# EasyEDA Pro project ProProject_TC264裸片板_2024-07-09.epro, schematic Schematic1
Create Date: 2024-06-23; Page Name: P1; Project Name: TC264裸片板; Schematic Name: Schematic1; Update Date: 2024-06-26; Company: 嘉立创EDA; Page Size: A4; Version: V1.0
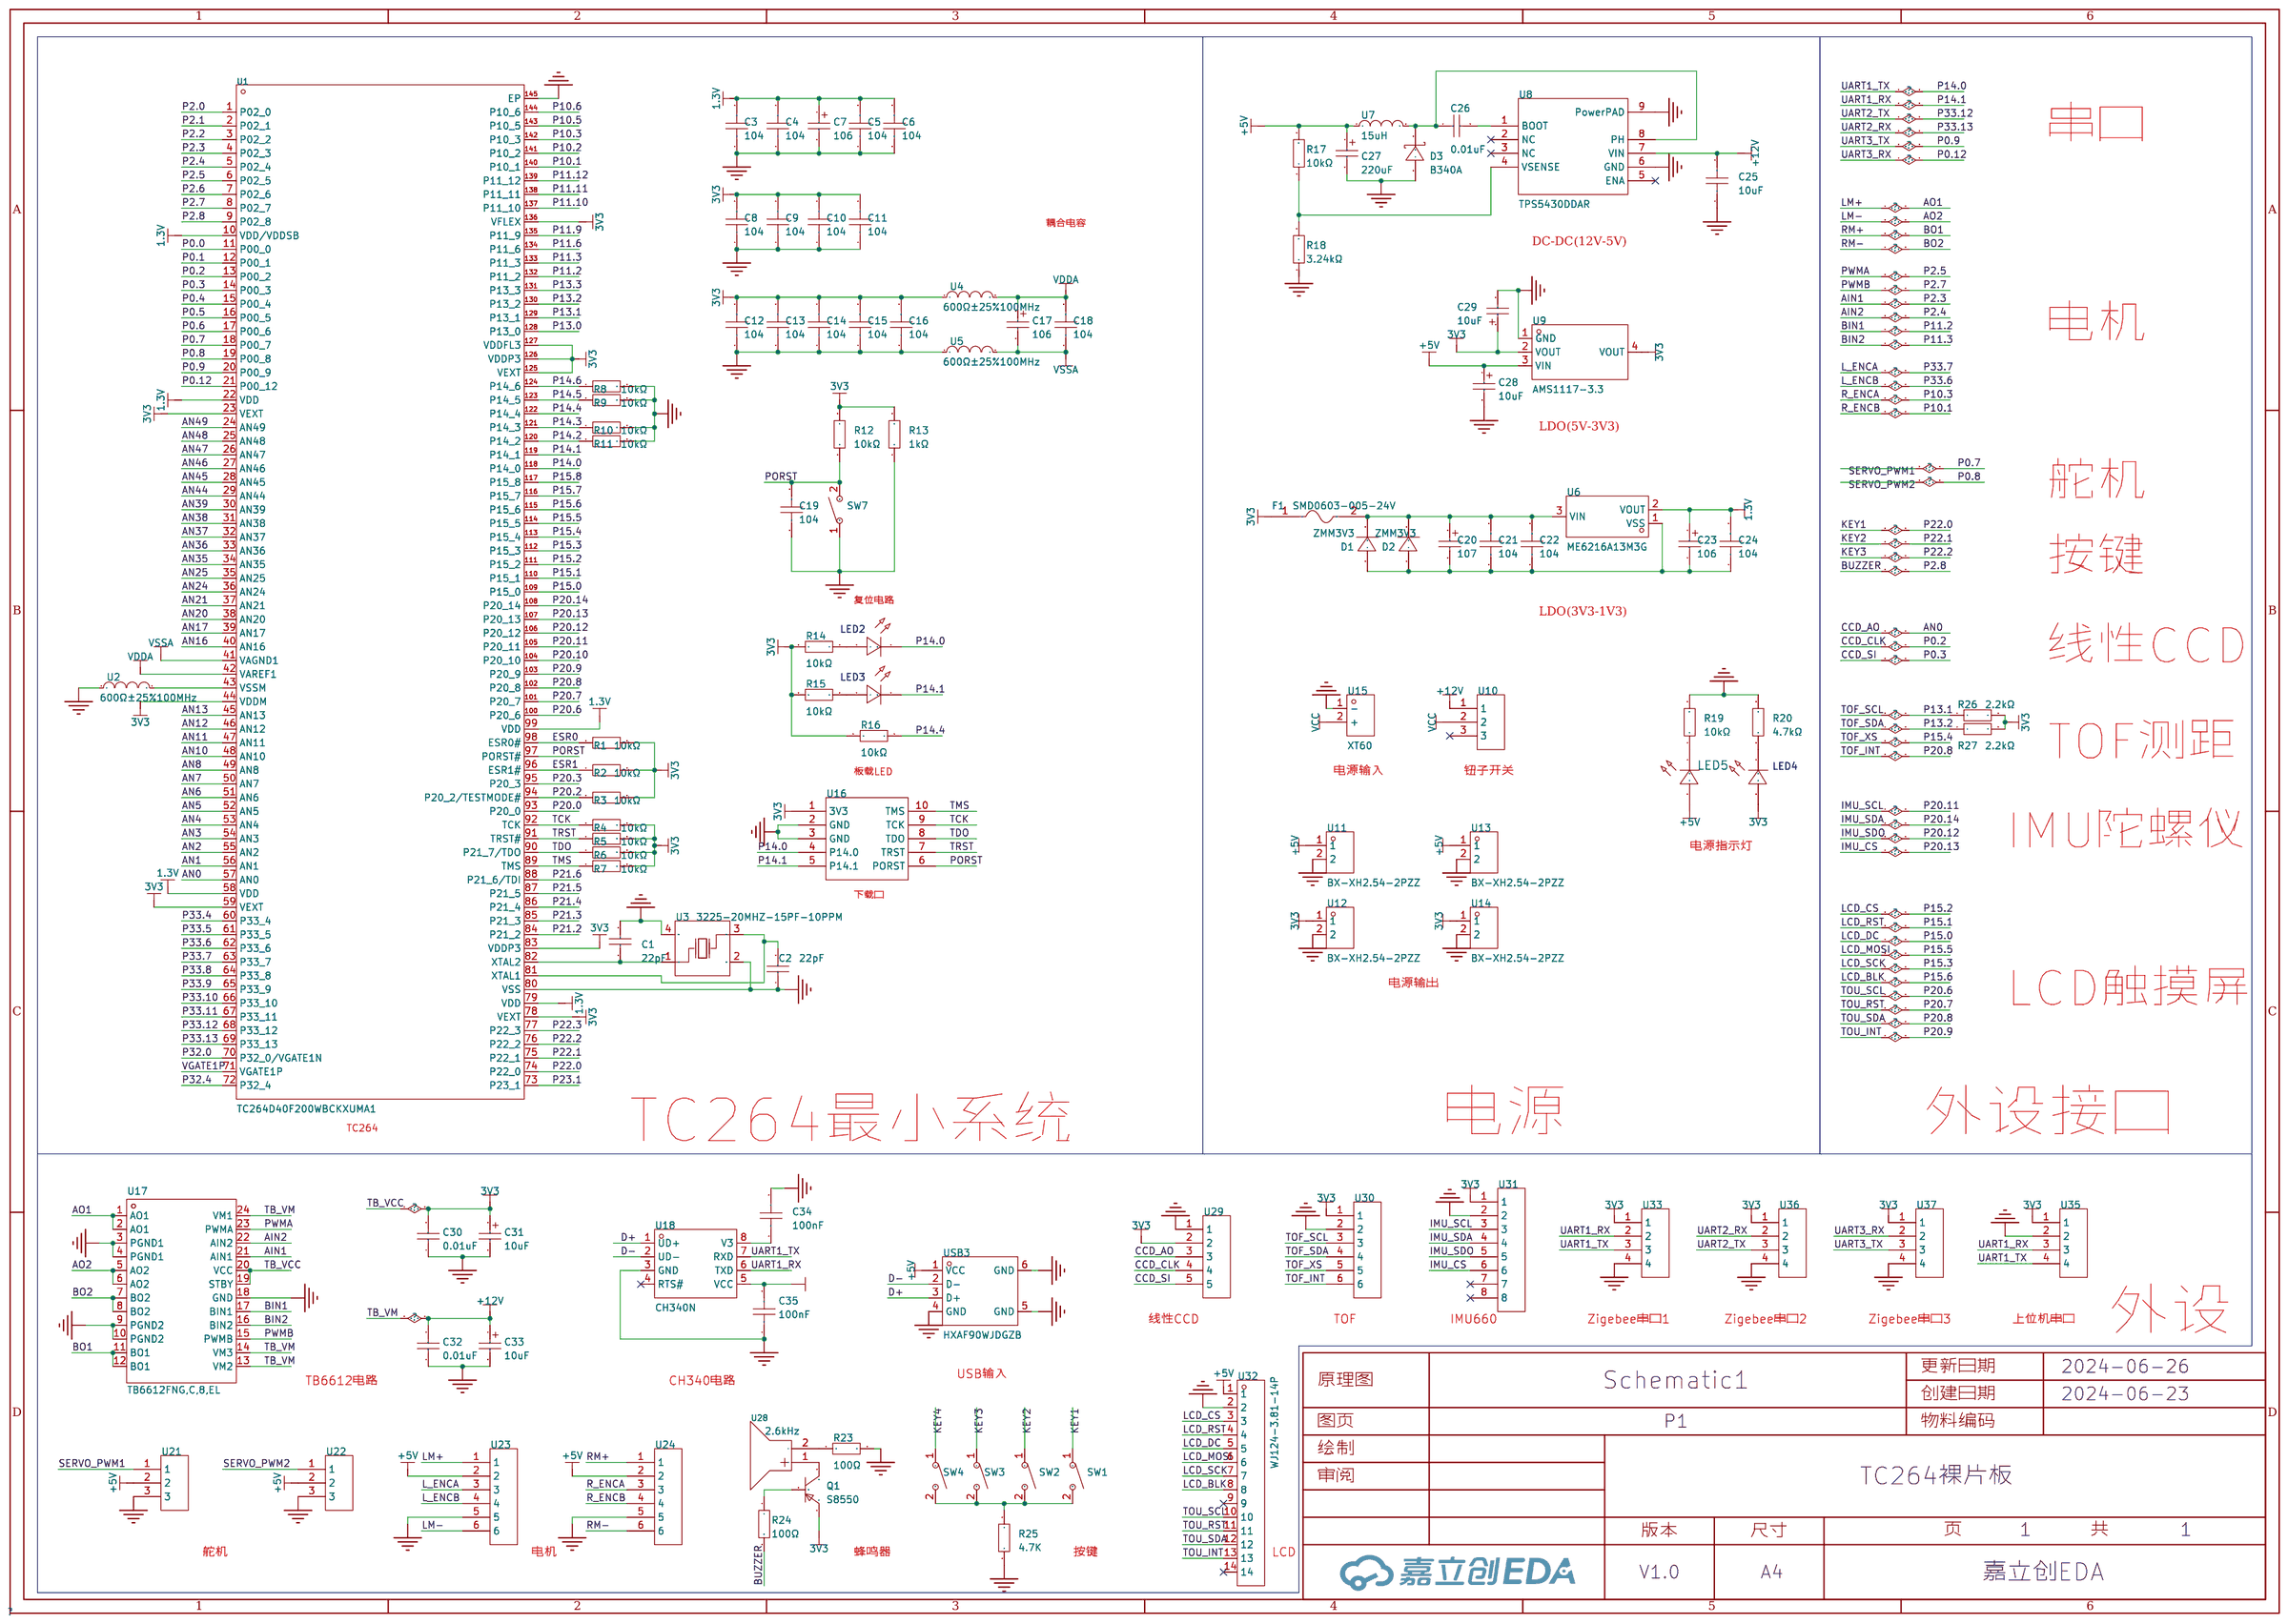
[diagram p0: schematic sheet]

## Parts
C1  22pF  [C0603]
C2  22pF  [C0603]
C3  104  [C0603]
C4  104  [C0603]
C5  104  [C0603]
C6  104  [C0603]
C7  106  [CAP-SMD_L3.2-W1.6-FD]
C8  104  [C0603]
C9  104  [C0603]
C10  104  [C0603]
C11  104  [C0603]
C12  104  [C0603]
C13  104  [C0603]
C14  104  [C0603]
C15  104  [C0603]
C16  104  [C0603]
C17  106  [CAP-SMD_L3.2-W1.6-FD]
C18  104  [C0603]
C19  104  [C0603]
C20  107  [CAP-SMD_L3.2-W1.6-FD]
C21  104  [C0603]
C22  104  [C0603]
C23  106  [CAP-SMD_L3.2-W1.6-FD]
C24  104  [C0603]
C25  10uF  [C0603]
C26  0.01uF  [C0603]
C27  220uF  [CAP-SMD_L6.0-W3.2-R-RD]
C28  10uF  [CAP-SMD_L6.0-W3.2-R-RD]
C29  10uF  [CAP-SMD_L6.0-W3.2-R-RD]
C30  0.01uF  [C0603]
C31  10uF  [CAP-SMD_L6.0-W3.2-R-RD]
C32  0.01uF  [C0603]
C33  10uF  [CAP-SMD_L6.0-W3.2-R-RD]
C34  100nF  [C0603]
C35  100nF  [C0603]
D1  ZMM3V3  [LL-34_L3.5-W1.5-LS3.5-FD]
D2  ZMM3V3  [LL-34_L3.5-W1.5-LS3.5-FD]
D3  B340A  [SMA_L4.3-W2.6-LS5.1-RD]
F1  SMD0603-005-24V  [F0603]
LED2  -  [LED_0603]
LED3  -  [LED_0603]
LED4  -  [LED_0402]
LED5  -  [LED_0402]
Q1  S8550  [SOT-23-3_L2.9-W1.6-P1.90-LS2.8-BR]
R1  10kΩ  [R0603]
R2  10kΩ  [R0603]
R3  10kΩ  [R0603]
R4  10kΩ  [R0603]
R5  10kΩ  [R0603]
R6  10kΩ  [R0603]
R7  10kΩ  [R0603]
R8  10kΩ  [R0603]
R9  10kΩ  [R0603]
R10  10kΩ  [R0603]
R11  10kΩ  [R0603]
R12  10kΩ  [R0603]
R13  1kΩ  [R0603]
R14  10kΩ  [R0603]
R15  10kΩ  [R0603]
R16  10kΩ  [R0603]
R17  10kΩ  [R0603]
R18  3.24kΩ  [R0603]
R19  10kΩ  [R0603]
R20  4.7kΩ  [R0603]
R23  100Ω  [R0603]
R24  100Ω  [R0603]
R25  4.7K  [R0603]
R26  2.2kΩ  [R0603]
R27  2.2kΩ  [R0603]
SW1  轻触按键3*6*2.5  [SW-SMD_L6.0-W3.6-LS8.0]
SW2  轻触按键3*6*2.5  [SW-SMD_L6.0-W3.6-LS8.0]
SW3  轻触按键3*6*2.5  [SW-SMD_L6.0-W3.6-LS8.0]
SW4  轻触按键3*6*2.5  [SW-SMD_L6.0-W3.6-LS8.0]
SW7  轻触按键3*6*2.5  [SW-SMD_L6.0-W3.6-LS8.0]
U1  TC264D40F200WBCKXUMA1  [LQFP-144_L20.0-W20.0-P0.50-LS22.0-BL-EP]
U2  600Ω±25%100MHz  [L0603]
U3  3225-20MHZ-15PF-10PPM  [CRYSTAL-SMD_4P-L3.2-W2.5-BL]
U4  600Ω±25%100MHz  [L0603]
U5  600Ω±25%100MHz  [L0603]
U6  ME6216A13M3G  [SOT-23-3_L3.0-W1.7-P0.95-LS2.9-BR]
U7  15uH  [IND-SMD_L6.6-W6.6]
U8  TPS5430DDAR  [ESOP-8_L4.9-W3.9-P1.27-LS6.0-TL-EP]
U9  AMS1117-3.3  [SOT-223-3_L6.5-W3.4-P2.30-LS7.0-BR]
U10  -  [钮子开关]
U11  BX-XH2.54-2PZZ  [CONN-TH_2P-P2.50_BX-XH2.54-2PZZ]
U12  BX-XH2.54-2PZZ  [CONN-TH_2P-P2.50_BX-XH2.54-2PZZ]
U13  BX-XH2.54-2PZZ  [CONN-TH_2P-P2.50_BX-XH2.54-2PZZ]
U14  BX-XH2.54-2PZZ  [CONN-TH_2P-P2.50_BX-XH2.54-2PZZ]
U15  XT60  [CONN-TH_XT60]
U16  -  [TC264]
U17  TB6612FNG,C,8,EL  [SSOP-24_L8.3-W5.6-P0.65-LS7.6-BL]
U18  CH340N  [SOP-8_L4.9-W3.9-P1.27-LS6.0-BL]
U21  -  [X2.54_3p]
U22  -  [X2.54_3p]
U23  -  [XH2.54_6p]
U24  -  [XH2.54_6p]
U28  2.6kHz  [BUZ-TH_BD12.0-P7.60-D0.6-FD]
U29  -  [X2.54_5p]
U30  -  [XH2.54_6p]
U31  -  [MPU6050-8p]
U32  WJ124-3.81-14P  [电容触摸]
U33  -  [XH2.54-4p]
U35  -  [XH2.54-4p]
U36  -  [XH2.54-4p]
U37  -  [XH2.54-4p]
USB3  HXAF90WJDGZB  [USB-A-TH_HXAF90WJDGZB]

## Library data of the parts
C1 C2 = CC0603JRNPO9BN220: 容值:22pF;精度:±5%;额定电压:50V;材质(温度系数):NP0;; LCSC Part Name: 22pF ±5% 50V; Supplier Part: C105620; Manufacturer: YAGEO(国巨); Supplier Footprint: 0603; JLCPCB Part Class: 扩展库; Datasheet: https://atta.szlcsc.com/upload/public/pdf/source/20170505/1493957838062.pdf; Supplier: LCSC; Tolerance: ±5%; Voltage Rated: 50V; Temperature Coefficient: NP0
C3-C6 C8-C16 C18 C19 C21 C22 C24 C34 = CAP_0603: Supplier Footprint: 0603
C7 C17 C20 C23 = C_Ele_SMD_3x5.4mm: Supplier Footprint: SMD,3x5.4mm
C25 = CL10A106KP8NNNC: 容值:10uF;精度:±10%;额定电压:10V;材质(温度系数):X5R;; LCSC Part Name: 10uF ±10% 10V; Supplier Part: C19702; Manufacturer: SAMSUNG(三星); Supplier Footprint: 0603; JLCPCB Part Class: 基础库; Datasheet: https://atta.szlcsc.com/upload/public/pdf/source/20160218/1457707763339.pdf; Supplier: LCSC; Tolerance: ±10%; Voltage Rated: 10V; Temperature Coefficient: X5R
C26 C30 C32 = CL10C100JB8NNNC: 容值:10pF;精度:±5%;额定电压:50V;材质(温度系数):C0G;; LCSC Part Name: 10pF ±5% 50V; Supplier Part: C1634; Manufacturer: SAMSUNG(三星); Supplier Footprint: 0603; JLCPCB Part Class: 基础库; Datasheet: https://atta.szlcsc.com/upload/public/pdf/source/20160218/1457707763339.pdf; Supplier: LCSC; Tolerance: ±5%; Voltage Rated: 50V; Temperature Coefficient: C0G
C27-C29 C31 C33 = TAJC227K010RNJ: 容值:220uF;精度:±10%;额定电压:10V;等效串联电阻:500mΩ@100kHz;; LCSC Part Name: 220uF ±10% 10V; Supplier Part: C8023; Manufacturer: Kyocera AVX; Supplier Footprint: CASE-C-6032; JLCPCB Part Class: 扩展库; Datasheet: https://atta.szlcsc.com/upload/public/pdf/source/20160107/1457707750344.pdf; Supplier: LCSC; Tolerance: ±10%; Rated Voltage: 10V; Equivalent Series Resistance(ESR): 500mΩ@100kHz; Operating Temperature: -55℃~+125℃
C35 = CAP_0805: Supplier Footprint: 0805; Origin Footprint 2: C0805
D1 D2 = ZMM3V3: 二极管配置:-;稳压值(标称值):3.3V;稳压值(范围):3.1V~3.5V;功率:500mW;精度:-;; Supplier Part: C2857242; Manufacturer: JSMSEMI(杰盛微); Supplier Footprint: LL-34; JLCPCB Part Class: 扩展库; Datasheet: https://atta.szlcsc.com/upload/public/pdf/source/20240105/AB2CCC1AF8AC07DFF2A37C65A0EBD01D.pdf; Supplier: LCSC; Zener Voltage (Nom): 3.3V; Reverse Leakage Current (Ir): 2uA@1V; Zener Voltage (Range): 3.1V~3.5V; Power Dissipation: 500mW; Zener Impedance (Zzt): 90Ω
D3 = B340A: 正向压降(Vf):550mV@3A;直流反向耐压(Vr):40V;平均整流电流(Io):3A;; LCSC Part Name: 电压:40V 电流:3A; Supplier Part: C64982; Manufacturer: MDD; Supplier Footprint: SMA(DO-214AC); JLCPCB Part Class: 扩展库; Datasheet: https://atta.szlcsc.com/upload/public/pdf/source/20230710/CC7CF81239BC87A7012E02A96905E83C.pdf; Supplier: LCSC; Forward Voltage (Vf@If): 550mV@3A; Reverse Voltage (Vr): 40V; Average Rectified Current (Io): 3A
F1 = SMD0603-005-24V: 最大电压:24V;最大电流:40A;保持电流:50mA;跳闸电流:200mA;; LCSC Part Name: 0.05A  24V 自恢复保险丝; Supplier Part: C70046; Manufacturer: 台湾陆海; Supplier Footprint: 0603; JLCPCB Part Class: 扩展库; Datasheet: https://atta.szlcsc.com/upload/public/pdf/source/20230404/2712EB29DF44AB86EE68CBFAEF7847D1.pdf; Supplier: LCSC; Operating Voltage (Max): 24V; Current Rating (Max): 40A; Hold Current: 50mA; Trip Current: 200mA
LED2 LED3 = LED_0603-G: Supplier Footprint: 0603
LED4 = LED_0402-G: Supplier Footprint: 0402
LED5 = LED_0402-R: Supplier Footprint: 0402
Q1 = S8550_C105432: 晶体管类型:PNP;集电极电流(Ic):500mA;集射极击穿电压(Vceo):25V;功率(Pd):300mW;直流电流增益(hFE@Ic,Vce):120@50mA,1V;; LCSC Part Name: S8550(RANGE:120-200) L档120-200; Supplier Part: C105432; Manufacturer: CJ(江苏长电/长晶); Supplier Footprint: SOT-23; JLCPCB Part Class: 基础库; Datasheet: https://atta.szlcsc.com/upload/public/pdf/source/20171228/C164891_15144412930301213894.pdf; Supplier: LCSC; Transistor Type: PNP; Collector Current (Ic): 500mA; Collector-Emitter Breakdown Voltage (Vceo): 25V; Power Dissipation (Pd): 300mW; DC Current Gain (hFE@Ic,Vce): 120@50mA,1V; Transition Frequency (fT): 150MHz; Collector Cut-Off Current (Icbo): 100nA; Collector-Emitter Saturation Voltage (VCE(sat)@Ic,Ib): 600mV@500mA,50mA
R1-R18 = 0603WAF1002T5E: 电阻类型:厚膜电阻;阻值:10kΩ;精度:±1%;功率:100mW;最大工作电压:75V;温度系数:±100ppm/℃;; LCSC Part Name: 厚膜电阻 10kΩ ±1% 100mW; Supplier Part: C25804; Manufacturer: UNI-ROYAL(厚声); Supplier Footprint: 0603; JLCPCB Part Class: 基础库; Datasheet: https://atta.szlcsc.com/upload/public/pdf/source/20200306/C422600_1E6D84923E4A46A82E41ADD87F860B5C.pdf; Supplier: LCSC; Type: 厚膜电阻; Tolerance: ±1%; Power(Watts): 100mW; Overload Voltage (Max): 75V; Temperature Coefficient: ±100ppm/℃; Operating Temperature Range: -55℃~+155℃
R19 R20 R26 R27 = 0603WAF4701T5E: 电阻类型:厚膜电阻;阻值:4.7kΩ;精度:±1%;功率:100mW;最大工作电压:75V;温度系数:±100ppm/℃;; LCSC Part Name: 4.7kΩ ±1% 100mW 厚膜电阻; Supplier Part: C23162; Manufacturer: UNI-ROYAL(厚声); Supplier Footprint: 0603; JLCPCB Part Class: 基础库; Datasheet: https://atta.szlcsc.com/upload/public/pdf/source/20200306/C422600_1E6D84923E4A46A82E41ADD87F860B5C.pdf; Supplier: LCSC; Type: 厚膜电阻; Tolerance: ±1%; Power(Watts): 100mW; Overload Voltage (Max): 75V; Temperature Coefficient: ±100ppm/℃; Operating Temperature Range: -55℃~+155℃
R23-R25 = Res_0603: Supplier Footprint: 0603
SW1-SW4 SW7 = 轻触按键3*6*2.5: Supplier Part: C9900013040; Supplier Footprint: KEY; JLCPCB Part Class: 扩展库; Supplier: LCSC
U1 = TC264D40F200WBCKXUMA1: CPU内核:其他系列;程序存储容量:2.5MB;RAM总容量:240KB;GPIO端口数量:88;工作电压范围:-;CPU最大主频:200MHz;程序存储器类型:FLASH;; Supplier Part: C1848806; Manufacturer: Infineon(英飞凌); Supplier Footprint: LQFP-144(20x20); JLCPCB Part Class: 扩展库; Datasheet: https://atta.szlcsc.com/upload/public/pdf/source/20211207/2726C98290045E30600065CD02247ED6.pdf; Supplier: LCSC; CPU Core: 其他系列; Program Storage Size: 2.5MB; RAM Size: 240KB; GPIO Ports Number: 88; CPU Maximum Speed: 200MHz; Program Memory Type: FLASH; Operating Temperature Range: -40℃~+125℃; ADC (Bit): 12bit; Peripheral/Function: DMA；看门狗；LIN总线协议；以太网协议栈; communication protocol: 以太网协议; Watchdog: 有; Direct Memory Access: 有; Internal Oscillator: 有
U2 U4 U5 = 600Ω±25%100MHz: Supplier Part: C9900021526; Supplier Footprint: L0805; JLCPCB Part Class: 扩展库; Supplier: LCSC
U3 = 3225-20MHZ-15PF-10PPM_C712026: Supplier Part: C712026; Supplier Footprint: SMD3225; JLCPCB Part Class: 扩展库; Supplier: LCSC
U6 = ME6216A13M3G: 输出类型:固定;最大输入电压:6V;输出电压:1.3V;最大输出电流:250mA;电源纹波抑制比(PSRR):65dB@(1kHz);输出极性:正极;; LCSC Part Name: 输入6V 输出1.3V 250mA; Supplier Part: C236662; Manufacturer: MICRONE(南京微盟); Supplier Footprint: SOT-23; JLCPCB Part Class: 扩展库; Datasheet: https://atta.szlcsc.com/upload/public/pdf/source/20180830/C126464_0BBD9EEE19BBEC9552A447E8A4FCE12E.pdf; Supplier: LCSC; Output Type: 固定; Maximum Input Voltage: 6V; Output Voltage: 1.3V; MAX Output Current: 250mA; Power Supply Rejection Ratio (PSRR): 65dB@(1kHz); Output Polarity: 正极; Number of Outputs: 1
U7 = 15uH: Supplier Part: C9900014578; Supplier Footprint: L_电感_7*7; JLCPCB Part Class: 扩展库; Supplier: LCSC
U8 = TPS5430DDAR: 功能类型:降压型;输出类型:可调;输入电压:5.5V~36V;输出电压:1.221V~32.04V;输出电流(最大值):3A;; LCSC Part Name: 降压 3A 36V; Supplier Part: C9864; Manufacturer: TI(德州仪器); Supplier Footprint: SOIC-8-EP; JLCPCB Part Class: 基础库; Datasheet: https://www.ti.com/cn/lit/gpn/tps5430; Supplier: LCSC; Function: 降压型; Output Type: 可调; Input Voltage: 5.5V~36V; Output Voltage: 1.221V~32.04V; Output Current (Max): 3A; Switching Frequency: 500kHz; Operating Temperature: -40℃~+125℃@(TJ); Synchronous Rectification: 否; Number of Outputs: 1; Topology: 降压式; Switch tube (built-in/external): 内置
U9 = AMS1117-3.3_C6186: 输出类型:固定;最大输入电压:-;输出电压:3.3V;最大输出电流:1A;电源纹波抑制比(PSRR):72dB@(120Hz);输出极性:正极;; LCSC Part Name: 输出3.3V 1A; Supplier Part: C6186; Manufacturer: AMS; Supplier Footprint: SOT-223; JLCPCB Part Class: 基础库; Datasheet: https://atta.szlcsc.com/upload/public/pdf/source/20180727/C6186_7A095716F0823C02F1997A905E26C086.pdf; Supplier: LCSC; Output Type: 固定; Output Voltage: 3.3V; MAX Output Current: 1A; Power Supply Rejection Ratio (PSRR): 72dB@(120Hz); Dropout Voltage: 1.3V@(800mA); Output Polarity: 正极; Number of Outputs: 1
U10 = 钮子开关
U11-U14 = BX-XH2.54-2PZZ: 插针结构:1x2P;间距:2.54mm;安装方式:直插;参考系列:XH;总PIN数:2P;排数:1;每排PIN数:2;行距:-;额定电流:3A;触头材质:黄铜;触头镀层:锡;工作温度范围:-25℃~+85℃;; Supplier Part: C18077833; Manufacturer: Bossie(博锡); Supplier Footprint: 插件,P=2.54mm; Datasheet: https://atta.szlcsc.com/upload/public/pdf/source/20231017/CB25E46A13930659CD6CDE2F2553A508.pdf; Supplier: LCSC; Pins Structure: 1x2P; Pitch: 2.54mm; Mounting Style: 直插; Reference Series: XH; Number of Pins: 2P; Number of Rows: 1; Number of PINs Per Row: 2; Current Rating (Max): 3A; Contact Material: 黄铜; Contact Plating: 锡; Operating Temperature Range: -25℃~+85℃
U15 = XT60: 类别:-;类型1:-;; LCSC Part Name: AMASS(艾迈斯) XT60模型插头 3.5mm镀金香蕉头公头（电调端）XT60-M; Supplier Part: C98733; Manufacturer: AMASS(艾迈斯); JLCPCB Part Class: 扩展库; Datasheet: https://atta.szlcsc.com/upload/public/pdf/source/20170606/1496716524919.pdf; Supplier: LCSC; Brand: 艾迈斯; Type: 香蕉头; Colour: 黄色; InterfaceType: 公头; specifications: 3.5mm
U16 = TC264下载口
U17 = TB6612FNG,C,8,EL: 驱动电机类型:有刷直流电机;电源电压:2.7V~5.5V;输出电流:1A;接口:并行;; LCSC Part Name: 1A 有刷直流电机驱动芯片 5.5V; Supplier Part: C141517; Manufacturer: TOSHIBA(东芝); Supplier Footprint: SSOP-24; JLCPCB Part Class: 扩展库; Datasheet: https://atta.szlcsc.com/upload/public/pdf/source/20171128/C141517_15118625624231147036.pdf; Supplier: LCSC; Drive motor type: 有刷直流电机; Supply Voltage: 2.7V~5.5V; Output Current: 1A; Interface: 并行; Operating Temperature: -20℃~+85℃@(Ta)
U18 = CH340N: LCSC Part Name: USB转串口芯片 CH340; Supplier Part: C2977777; Manufacturer: WCH(南京沁恒); Supplier Footprint: SOP-8; JLCPCB Part Class: 扩展库; Datasheet: https://atta.szlcsc.com/upload/public/pdf/source/20230530/6E401E9554E9F5311886CC8B3F89B62E.pdf; Supplier: LCSC
U21 U22 = X2.54 _3p
U23 U24 U30 = XH2.54_6p
U28 = HYE1206-05ST: 频率:2.6kHz;声压(SPL):80dB@5V,10cm;; LCSC Part Name: 有源蜂鸣器HYE1206-05ST; Supplier Part: C17701079; Manufacturer: HYDZ(华宇); Supplier Footprint: 插件,D=7.6mm; Datasheet: https://atta.szlcsc.com/upload/public/pdf/source/20230912/EF3443D3A1B92F495A3EE65EE7F2091F.pdf; Supplier: LCSC; Sound Pressure Level (SPL): 80dB@5V,10cm
U29 = X2.54_5p
U31 = MPU6050_8p
U32 = WJ124-3.81-14P: Supplier Part: C9900012814; Supplier Footprint: 3.81-14P; JLCPCB Part Class: 扩展库; Supplier: LCSC
U33 U35-U37 = XH2.54_4P
USB3 = HXAF90WJDGZB: Supplier Part: C9900088453; Supplier Footprint: USB母座; JLCPCB Part Class: 扩展库; Supplier: LCSC

## Nets
1.3V: C3.2 C4.2 C5.2 C6.2 C7.1 C23.1 C24.2 U1.10(VDD/VDDSB) U1.22(VDD) U1.58(VDD) U1.79(VDD) U1.99(VDD) U6.2(VOUT)
3V3: C8.2 C9.2 C10.2 C11.2 C12.2 C13.2 C14.2 C15.2 C16.2 C29.1 C30.2 C31.1 C35.2 F1.1 LED4.2(A) Q1.2 R1.2 R2.2 R3.2 R4.2 R5.2 R6.2 R7.2 R12.2 R13.2 R14.2 R15.2 R16.2 R26.2 R27.2 U1.23(VEXT) U1.44(VDDM) U1.59(VEXT) U1.78(VEXT) U1.83(VDDP3) U1.125(VEXT) U1.126(VDDP3) U1.127(VDDFL3) U1.136(VFLEX) U4.1 U9.2(VOUT) U9.4(VOUT) U12.1 U14.1 U16.1(3V3) U17.19(STBY) U17.20(VCC) U18.5(VCC) U29.2 U30.1 U31.1 U33.1 U35.1 U36.1 U37.1
+5V: C27.1 C28.1 LED5.2(A) R17.2 U7.1 U9.3(VIN) U11.1 U13.1 U21.2 U22.2 U23.2 U24.2 U32.1 USB3.1(VCC)
+12V: C25.2 C32.2 C33.1 U8.7(VIN) U10.1 U17.13(VM2) U17.14(VM3) U17.24(VM1)
GND: C1.2 C2.1 C3.1 C4.1 C5.1 C6.1 C7.2 C8.1 C9.1 C10.1 C11.1 C12.1 C13.1 C14.1 C15.1 C16.1 C19.1 C25.1 C27.2 C28.2 C29.2 C30.1 C31.2 C32.1 C33.2 C34.2 C35.1 D3.2(A) R8.2 R9.2 R10.2 R11.2 R13.1 R18.1 R19.2 R20.2 R23.2 R25.2 SW7.1 U1.80(VSS) U1.145(EP) U2.1 U3.2(GND) U3.4(GND) U5.1 U8.6(GND) U8.9(PowerPAD) U9.1(GND) U11.2 U12.2 U13.2 U14.2 U15.1(-) U16.2(GND) U16.3(GND) U17.3(PGND1) U17.4(PGND1) U17.9(PGND2) U17.10(PGND2) U17.18(GND) U18.3(GND) U21.3 U22.3 U23.5 U24.5 U29.1 U30.2 U31.2 U32.2 U33.4 U35.2 U36.4 U37.4 USB3.4(GND) USB3.5(GND) USB3.6(GND)
VCC: U10.2 U15.2(+)
VDDA: C17.1 C18.2 U1.42(VAREF1) U4.2
VSSA: C17.2 C18.1 U1.41(VAGND1) U5.2
AIN1: U1.4(P02_3) U17.21(AIN1)
AIN2: U1.5(P02_4) U17.22(AIN2)
AN0: U1.57(AN0) U29.3
AN1: U1.56(AN1)
AN2: U1.55(AN2)
AN3: U1.54(AN3)
AN4: U1.53(AN4)
AN5: U1.52(AN5)
AN6: U1.51(AN6)
AN7: U1.50(AN7)
AN8: U1.49(AN8)
AN10: U1.48(AN10)
AN11: U1.47(AN11)
AN12: U1.46(AN12)
AN13: U1.45(AN13)
AN16: U1.40(AN16)
AN17: U1.39(AN17)
AN20: U1.38(AN20)
AN21: U1.37(AN21)
AN24: U1.36(AN24)
AN25: U1.35(AN25)
AN35: U1.34(AN35)
AN36: U1.33(AN36)
AN37: U1.32(AN37)
AN38: U1.31(AN38)
AN39: U1.30(AN39)
AN44: U1.29(AN44)
AN45: U1.28(AN45)
AN46: U1.27(AN46)
AN47: U1.26(AN47)
AN48: U1.25(AN48)
AN49: U1.24(AN49)
AO1: U17.1(AO1) U17.2(AO1) U23.1
AO2: U17.5(AO2) U17.6(AO2) U23.6
BIN1: U1.132(P11_2) U17.17(BIN1)
BIN2: U1.133(P11_3) U17.16(BIN2)
BO1: U17.11(BO1) U17.12(BO1) U24.1
BO2: U17.7(BO2) U17.8(BO2) U24.6
BUZZER: R24.2 U1.9(P02_8)
CCD_CLK: U1.13(P00_2) U29.4
CCD_SI: U1.14(P00_3) U29.5
D+: U18.1(UD+) USB3.3(D+)
D-: U18.2(UD-) USB3.2(D-)
ESR0: R1.1 U1.98(ESR0#)
ESR1: R2.1 U1.96(ESR1#)
IMU_CS: U1.107(P20_13) U31.6
IMU_SCL: U1.105(P20_11) U31.3
IMU_SDA: U1.108(P20_14) U31.4
IMU_SDO: U1.106(P20_12) U31.5
KEY1: SW1.1 U1.74(P22_0)
KEY2: SW2.1 U1.75(P22_1)
KEY3: SW3.1 U1.76(P22_2)
KEY4: SW4.1
L_ENCA: U1.63(P33_7) U23.3
L_ENCB: U1.62(P33_6) U23.4
LCD_BLK: U1.115(P15_6) U32.8
LCD_CS: U1.111(P15_2) U32.3
LCD_DC: U1.109(P15_0) U32.5
LCD_MOSI: U1.114(P15_5) U32.6
LCD_RST: U1.110(P15_1) U32.4
LCD_SCK: U1.112(P15_3) U32.7
P0.0: U1.11(P00_0)
P0.1: U1.12(P00_1)
P0.4: U1.15(P00_4)
P0.5: U1.16(P00_5)
P0.6: U1.17(P00_6)
P0.7: U1.18(P00_7) U21.1
P0.8: U1.19(P00_8) U22.1
P0.9: U1.20(P00_9) U37.3
P0.12: U1.21(P00_12) U37.2
P2.0: U1.1(P02_0)
P2.1: U1.2(P02_1)
P2.2: U1.3(P02_2)
P2.5: U1.6(P02_5) U17.23(PWMA)
P2.6: U1.7(P02_6)
P2.7: U1.8(P02_7) U17.15(PWMB)
P10.1: U1.140(P10_1) U24.4
P10.2: U1.141(P10_2)
P10.3: U1.142(P10_3) U24.3
P10.5: U1.143(P10_5)
P10.6: U1.144(P10_6)
P11.6: U1.134(P11_6)
P11.9: U1.135(P11_9)
P11.10: U1.137(P11_10)
P11.11: U1.138(P11_11)
P11.12: U1.139(P11_12)
P13.0: U1.128(P13_0)
P13.1: R26.1 U1.129(P13_1) U30.3
P13.2: R27.1 U1.130(P13_2) U30.4
P13.3: U1.131(P13_3)
P14.0: LED2.1(C) U1.118(P14_0) U16.4(P14.0) U18.7(RXD) U33.3 U35.4
P14.1: LED3.1(C) U1.119(P14_1) U16.5(P14.1) U18.6(TXD) U33.2 U35.3
P14.2: R11.1 U1.120(P14_2)
P14.3: R10.1 U1.121(P14_3)
P14.4: R16.1 U1.122(P14_4)
P14.5: R9.1 U1.123(P14_5)
P14.6: R8.1 U1.124(P14_6)
P15.4: U1.113(P15_4) U30.5
P15.7: U1.116(P15_7)
P15.8: U1.117(P15_8)
P20.0: U1.93(P20_0)
P20.2: R3.1 U1.94(P20_2/TESTMODE#)
P20.3: U1.95(P20_3)
P20.6: U1.100(P20_6) U32.10
P20.7: U1.101(P20_7) U32.11
P20.8: U1.102(P20_8) U30.6 U32.12
P20.9: U1.103(P20_9) U32.13
P20.10: U1.104(P20_10)
P21.2: U1.84(P21_2)
P21.3: U1.85(P21_3)
P21.4: U1.86(P21_4)
P21.5: U1.87(P21_5)
P21.6: U1.88(P21_6/TDI)
P22.3: U1.77(P22_3)
P23.1: U1.73(P23_1)
P32.0: U1.70(P32_0/VGATE1N)
P32.4: U1.72(P32_4)
P33.4: U1.60(P33_4)
P33.5: U1.61(P33_5)
P33.8: U1.64(P33_8)
P33.9: U1.65(P33_9)
P33.10: U1.66(P33_10)
P33.11: U1.67(P33_11)
P33.12: U1.68(P33_12) U36.3
P33.13: U1.69(P33_13) U36.2
PORST: C19.2 R12.1 SW7.2 U1.97(PORST#) U16.6(PORST)
TCK: R4.1 U1.92(TCK) U16.9(TCK)
TDO: R6.1 U1.90(P21_7/TDO) U16.8(TDO)
TMS: R7.1 U1.89(TMS) U16.10(TMS)
TRST: R5.1 U1.91(TRST#) U16.7(TRST)
VGATE1P: U1.71(VGATE1P)
$1N4159: U1.43(VSSM) U2.2
$1N5074: C1.1 U1.82(XTAL2) U3.1(OSC1)
$1N5220: C2.2 U1.81(XTAL1) U3.3(OSC2)
$1N7124: LED2.2(A) R14.1
$1N7149: LED3.2(A) R15.1
$1N7661: C20.1 C21.2 C22.2 D1.2(C) D2.2(C) F1.2 U6.3(VIN)
$1N7734: C20.2 C21.1 C22.1 C23.2 C24.1 D1.1(A) D2.1(A) U6.1(VSS)
$1N8172: C26.2 U8.1(BOOT)
$1N8173: C26.1 D3.1(K) U7.2 U8.8(PH)
$1N8175: R17.1 R18.2 U8.4(VSENSE)
$1N8904: LED4.1(C) R20.1
$1N8906: LED5.1(C) R19.1
$1N14813: Q1.3 U28.1(+)
$1N14815: Q1.1 R24.1
$1N14820: R23.1 U28.2(-)
Net-(C34-1): C34.1 U18.8(V3)
Net-(R25-1): R25.1 SW1.2 SW2.2 SW3.2 SW4.2

Not connected (* = marked no-connect by the designer): U8 2(NC)* 3(NC)* 5(ENA)*; U10 3*; U18 4(RTS#)*; U31 7* 8*; U32 9* 14*

## Notes on the sheet
- 串口
- 耦合电容
- DC-DC(12V-5V)
- 电机
- LDO(5V-3V3)
- 舵机
- 按键
- 复位电路
- LDO(3V3-1V3)
- 线性CCD
- 板载LED
- 电源输入
- 钮子开关
- TOF测距
- 电源指示灯
- IMU陀螺仪
- 下载口
- 电源输出
- LCD触摸屏
- TC264
- TC264最小系统
- 电源
- 外设接口
- 线性CCD
- TOF
- IMU660
- Zigebee串口1
- Zigebee串口2
- Zigebee串口3
- 上位机串口
- 外设
- TB6612电路
- CH340电路
- USB输入
- 舵机
- 电机
- 蜂鸣器
- 按键
- LCD
